# Altium schematic sheet Main.SchDoc
size A3; SheetNumber: 1; SheetTotal: 5; SPICEModelCacheLDJSNXER: <root> / <DocumentId>LDJSNXER</DocumentId> / <CacheFrame Number="0"> / <Model Name="861141486026_680uf" Kind="CKT"> / <Text>******* / .subckt 861141486026_680uF 1 2 / Rser 1 3 0.06 / Lser 2 4 1.05528512515298E-08 / C1 3 4 0.00068 / Rpar 3 4 271162.745854223 / .ends 861141486026_680uF</Text> / </Model> / <Model Name="890263425004cs_2.2uf" Kind="CKT"> / <Text>******* / .subckt 890263425004CS_2.2uF 1 2 / Rser 1 3 0.0196538190645 / Lser 2 4 1.1417797143E-08 / C1 3 4 0.0000022 / Rpar 3 4 1363636363.63636 / .ends 890263425004CS_2.2uF</Text> / </Model> / </CacheFrame> / </root>
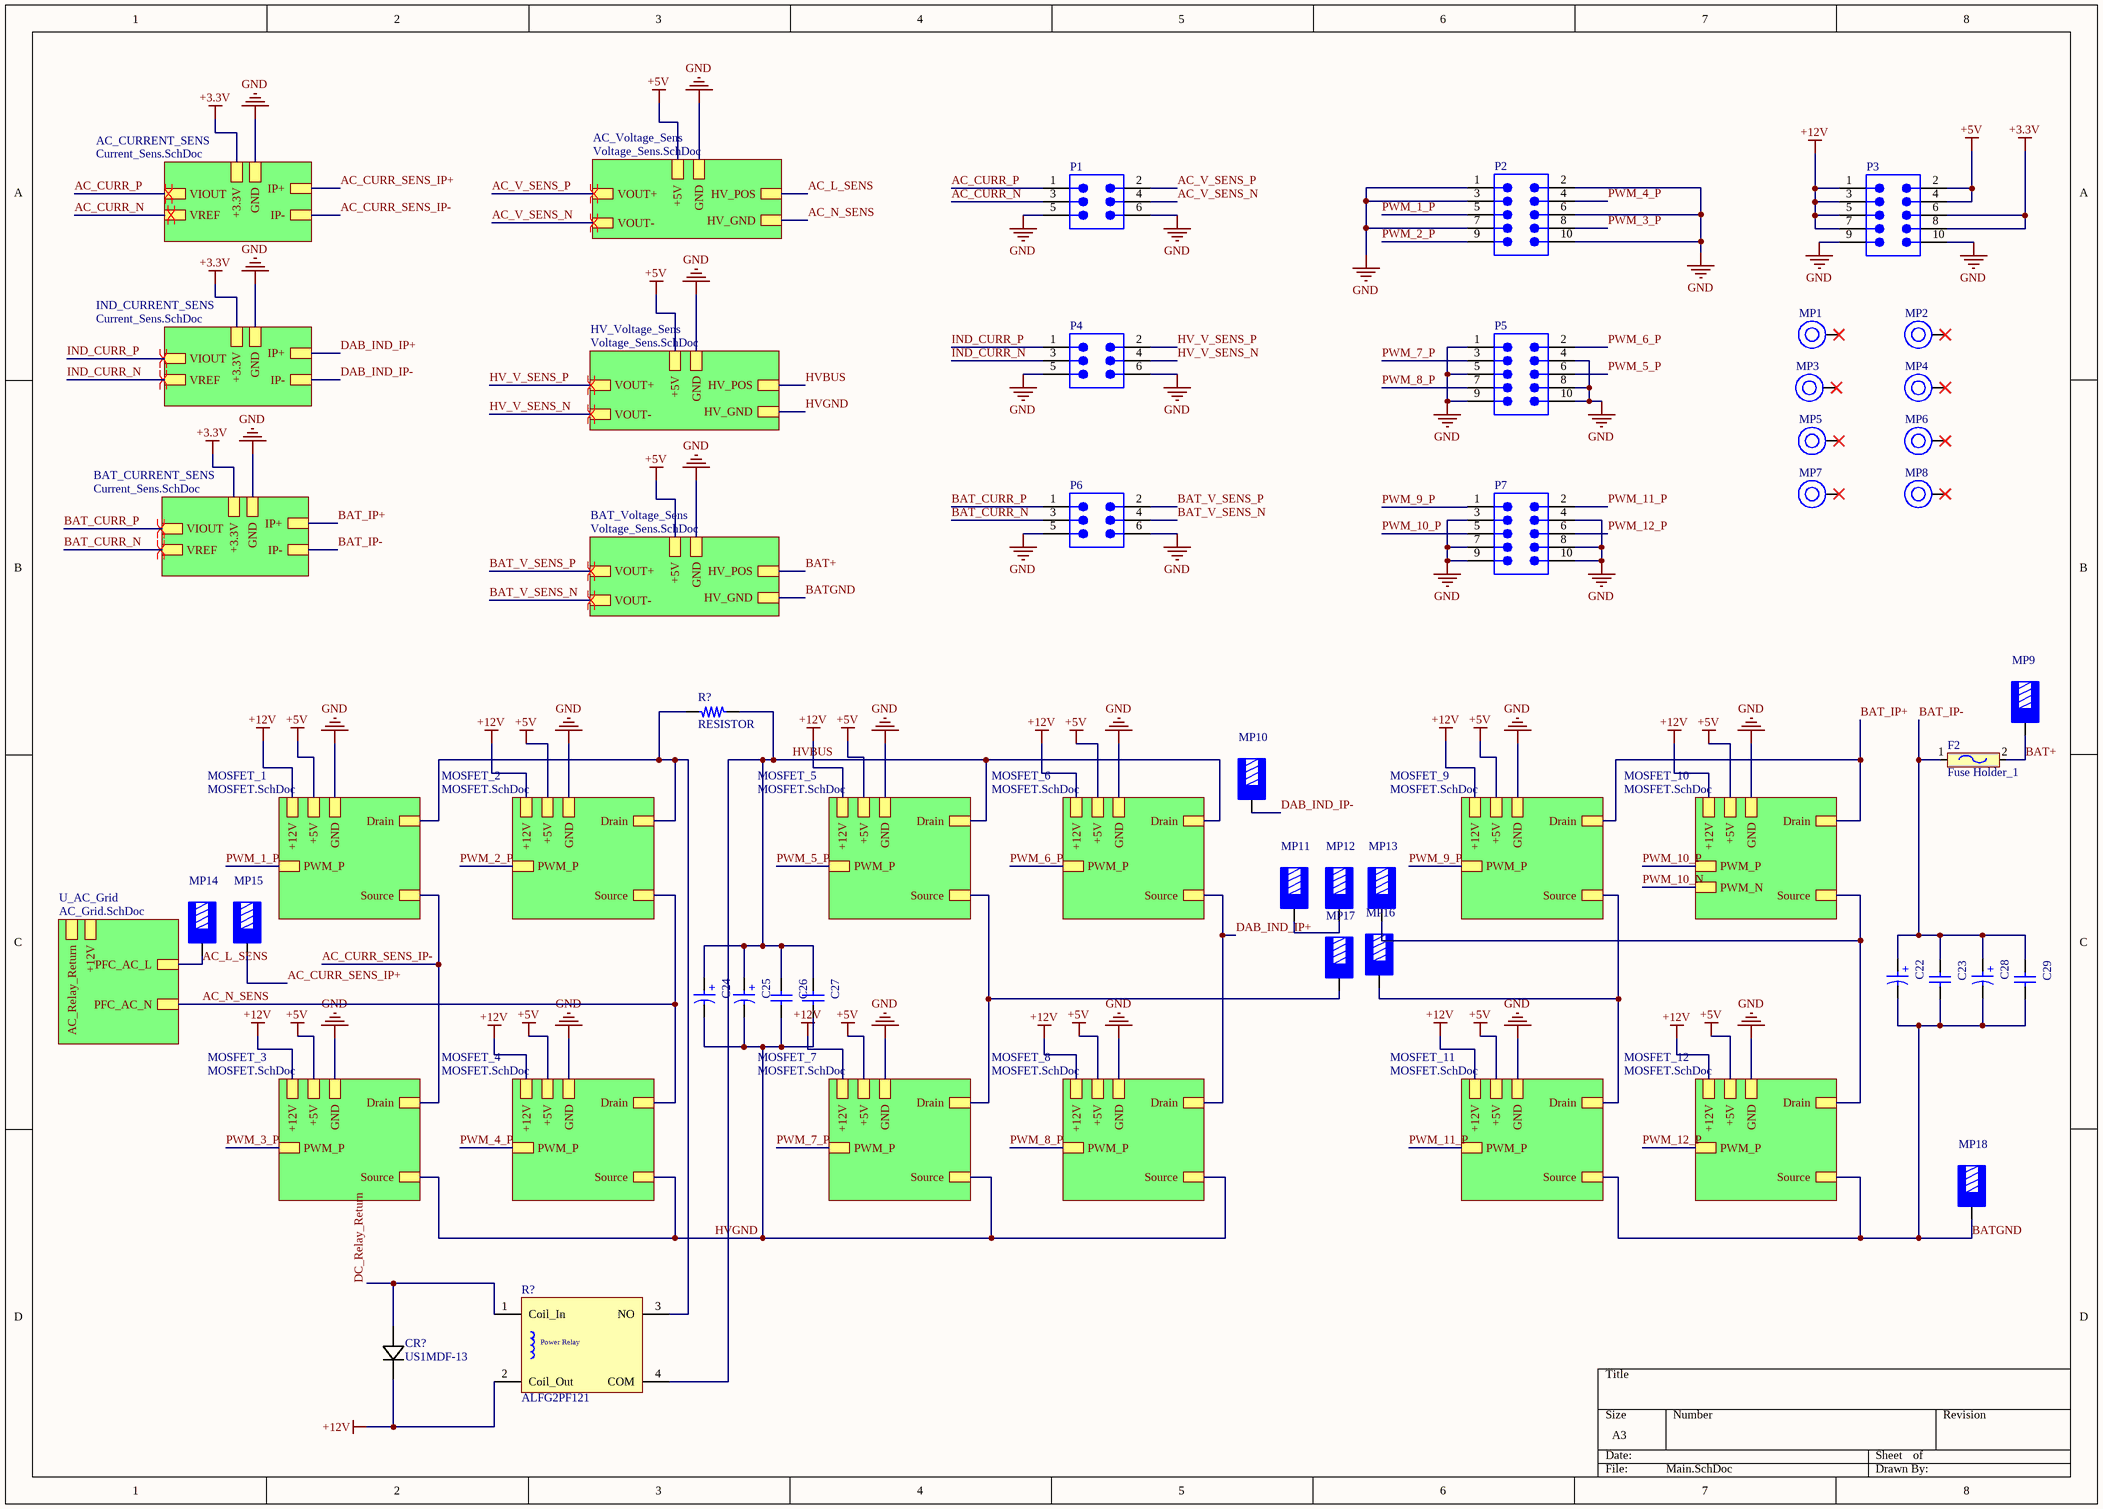
[diagram p0: Main.SchDoc]

## Parts
(Parts that share a designator on the sheet are numbered #1, #2 ... from top to bottom, then left to right.)
C22  680µF  [WCAP-AI3H_D35H55]  (value not drawn)
C23  1.5µF  [WCAP-FTBE_L31W15H24.5]  (value not drawn)
C24  680µF  [WCAP-AI3H_D35H55]  (value not drawn)
C25  680µF  [WCAP-AI3H_D35H55]  (value not drawn)
C26  1.5µF  [WCAP-FTBE_L31W15H24.5]  (value not drawn)
C27  1.5µF  [WCAP-FTBE_L31W15H24.5]  (value not drawn)
C28  680µF  [WCAP-AI3H_D35H55]  (value not drawn)
C29  1.5µF  [WCAP-FTBE_L31W15H24.5]  (value not drawn)
CR?  US1MDF-13  [DIODE_US1MDF-13_DIO-M]
F2  Fuse Holder_1  [Fuse Holder]
MP1  M3 x 10mm  [78614100360]  (value not drawn)
MP2  M3 x 10mm  [78614100360]  (value not drawn)
MP3  M3 x 10mm  [78614100360]  (value not drawn)
MP4  M3 x 10mm  [78614100360]  (value not drawn)
MP5  M3 x 10mm  [78614100360]  (value not drawn)
MP6  M3 x 10mm  [78614100360]  (value not drawn)
MP7  M3 x 10mm  [78614100360]  (value not drawn)
MP8  M3 x 10mm  [78614100360]  (value not drawn)
MP9  M4 x 6mm  [7460307_chemical surface]  (value not drawn)
MP10  M4 x 6mm  [7460307_chemical surface]  (value not drawn)
MP11  M4 x 6mm  [7460307_chemical surface]  (value not drawn)
MP12  M4 x 6mm  [7460307_chemical surface]  (value not drawn)
MP13  M4 x 6mm  [7460307_chemical surface]  (value not drawn)
MP14  M4 x 6mm  [7460307_chemical surface]  (value not drawn)
MP15  M4 x 6mm  [7460307_chemical surface]  (value not drawn)
MP16  M4 x 6mm  [7460307_chemical surface]  (value not drawn)
MP17  M4 x 6mm  [7460307_chemical surface]  (value not drawn)
MP18  M4 x 6mm  [7460307_chemical surface]  (value not drawn)
P1  61300621121  [61300621121]  (value not drawn)
P2  61301021121  [61301021121]  (value not drawn)
P3  61301021121  [61301021121]  (value not drawn)
P4  61300621121  [61300621121]  (value not drawn)
P5  61301021121  [61301021121]  (value not drawn)
P6  61300621121  [61300621121]  (value not drawn)
P7  61301021121  [61301021121]  (value not drawn)
R?#1  RESISTOR  [Power Resistor]
R?#2  ALFG2PF121  [Power Relay]

## Sub-sheets
AC_CURRENT_SENS = Current_Sens.SchDoc: +3.3V, GND, VIOUT, VREF, IP+, IP-
AC_Voltage_Sens = Voltage_Sens.SchDoc: VOUT+, VOUT-, HV_POS, HV_GND, +5V, GND
BAT_CURRENT_SENS = Current_Sens.SchDoc: +3.3V, GND, VIOUT, VREF, IP+, IP-
BAT_Voltage_Sens = Voltage_Sens.SchDoc: VOUT+, VOUT-, HV_POS, HV_GND, +5V, GND
HV_Voltage_Sens = Voltage_Sens.SchDoc: VOUT+, VOUT-, HV_POS, HV_GND, +5V, GND
IND_CURRENT_SENS = Current_Sens.SchDoc: +3.3V, GND, VIOUT, VREF, IP+, IP-
MOSFET_1 = MOSFET.SchDoc: PWM_P, Drain, Source, +12V, +5V, GND
MOSFET_2 = MOSFET.SchDoc: PWM_P, Drain, Source, +12V, +5V, GND
MOSFET_3 = MOSFET.SchDoc: PWM_P, Drain, Source, +12V, +5V, GND
MOSFET_4 = MOSFET.SchDoc: PWM_P, Drain, Source, +12V, +5V, GND
MOSFET_5 = MOSFET.SchDoc: PWM_P, Drain, Source, +12V, +5V, GND
MOSFET_6 = MOSFET.SchDoc: PWM_P, Drain, Source, +12V, +5V, GND
MOSFET_7 = MOSFET.SchDoc: PWM_P, Drain, Source, +12V, +5V, GND
MOSFET_8 = MOSFET.SchDoc: PWM_P, Drain, Source, +12V, +5V, GND
MOSFET_9 = MOSFET.SchDoc: PWM_P, Drain, Source, +12V, +5V, GND
MOSFET_10 = MOSFET.SchDoc: PWM_P, PWM_N, Drain, Source, +12V, +5V, GND
MOSFET_11 = MOSFET.SchDoc: PWM_P, Drain, Source, +12V, +5V, GND
MOSFET_12 = MOSFET.SchDoc: PWM_P, Drain, Source, +12V, +5V, GND
U_AC_Grid = AC_Grid.SchDoc: PFC_AC_L, PFC_AC_N, +12V, AC_Relay_Return

## Nets
+3.3V: P3.6 P3.8 ; sheet AC_CURRENT_SENS/+3.3V, sheet IND_CURRENT_SENS/+3.3V, sheet BAT_CURRENT_SENS/+3.3V
+5V: P3.2 P3.4 ; sheet MOSFET_1/+5V, sheet AC_Voltage_Sens/+5V, sheet MOSFET_3/+5V, sheet MOSFET_2/+5V, sheet MOSFET_4/+5V, sheet MOSFET_5/+5V, sheet MOSFET_7/+5V, sheet MOSFET_6/+5V, sheet MOSFET_8/+5V, sheet MOSFET_9/+5V, sheet MOSFET_11/+5V, sheet MOSFET_10/+5V, sheet MOSFET_12/+5V, sheet HV_Voltage_Sens/+5V, sheet BAT_Voltage_Sens/+5V
+12V: CR?.1 P3.1 P3.3 P3.5 P3.7 R?#2.2(Coil_Out) ; sheet MOSFET_1/+12V, sheet MOSFET_3/+12V, sheet MOSFET_2/+12V, sheet MOSFET_4/+12V, sheet MOSFET_5/+12V, sheet MOSFET_7/+12V, sheet MOSFET_6/+12V, sheet MOSFET_8/+12V, sheet MOSFET_9/+12V, sheet MOSFET_11/+12V, sheet MOSFET_10/+12V, sheet MOSFET_12/+12V
GND: P1.5 P1.6 P2.1 P2.2 P2.3 P2.6 P2.7 P2.10 P3.9 P3.10 P4.5 P4.6 P5.1 P5.4 P5.5 P5.8 P5.9 P5.10 P6.5 P6.6 P7.3 P7.4 P7.7 P7.8 P7.9 P7.10 ; sheet MOSFET_1/GND, sheet AC_Voltage_Sens/GND, sheet MOSFET_3/GND, sheet MOSFET_2/GND, sheet MOSFET_4/GND, sheet MOSFET_5/GND, sheet MOSFET_7/GND, sheet MOSFET_6/GND, sheet MOSFET_8/GND, sheet MOSFET_9/GND, sheet MOSFET_11/GND, sheet MOSFET_10/GND, sheet MOSFET_12/GND, sheet AC_CURRENT_SENS/GND, sheet IND_CURRENT_SENS/GND, sheet BAT_CURRENT_SENS/GND, sheet HV_Voltage_Sens/GND, sheet BAT_Voltage_Sens/GND
AC_CURR_N: P1.3 ; sheet AC_CURRENT_SENS/VREF
AC_CURR_P: P1.1 ; sheet AC_CURRENT_SENS/VIOUT
AC_CURR_SENS_IP+: MP15.1 ; sheet AC_CURRENT_SENS/IP+
AC_CURR_SENS_IP-: sheet MOSFET_1/Source, sheet MOSFET_3/Drain, sheet AC_CURRENT_SENS/IP-
AC_L_SENS: MP14.1 ; sheet U_AC_Grid/PFC_AC_L, sheet AC_Voltage_Sens/HV_POS
AC_N_SENS: sheet U_AC_Grid/PFC_AC_N, sheet AC_Voltage_Sens/HV_GND, sheet MOSFET_2/Source, sheet MOSFET_4/Drain
AC_V_SENS_N: P1.4 ; sheet AC_Voltage_Sens/VOUT-
AC_V_SENS_P: P1.2 ; sheet AC_Voltage_Sens/VOUT+
BAT+: F2.2(VCC26) MP9.1 ; sheet BAT_Voltage_Sens/HV_POS
BAT_CURR_N: P6.3 ; sheet BAT_CURRENT_SENS/VREF
BAT_CURR_P: P6.1 ; sheet BAT_CURRENT_SENS/VIOUT
BAT_IP+: sheet MOSFET_9/Drain, sheet MOSFET_10/Drain, sheet BAT_CURRENT_SENS/IP+
BAT_IP-: C22.1(P) C23.1 C28.1(P) C29.1 F2.1(VCC27) ; sheet BAT_CURRENT_SENS/IP-
BAT_V_SENS_N: P6.4 ; sheet BAT_Voltage_Sens/VOUT-
BAT_V_SENS_P: P6.2 ; sheet BAT_Voltage_Sens/VOUT+
BATGND: C22.2(N) C23.2 C28.2(N) C29.2 MP18.1 ; sheet MOSFET_11/Source, sheet MOSFET_12/Source, sheet BAT_Voltage_Sens/HV_GND
DAB_IND_IP+: sheet MOSFET_6/Source, sheet MOSFET_8/Drain, sheet IND_CURRENT_SENS/IP+
DAB_IND_IP-: MP10.1 ; sheet IND_CURRENT_SENS/IP-
DC_Relay_Return: CR?.2 R?#2.1(Coil_In)
HV_V_SENS_N: P4.4 ; sheet HV_Voltage_Sens/VOUT-
HV_V_SENS_P: P4.2 ; sheet HV_Voltage_Sens/VOUT+
HVBUS: C24.1(P) C25.1(P) C26.1 C27.1 R?#1.2(BOT) R?#2.4(COM) ; sheet MOSFET_5/Drain, sheet MOSFET_6/Drain, sheet HV_Voltage_Sens/HV_POS
HVGND: C24.2(N) C25.2(N) C26.2 C27.2 ; sheet MOSFET_3/Source, sheet MOSFET_4/Source, sheet MOSFET_7/Source, sheet MOSFET_8/Source, sheet HV_Voltage_Sens/HV_GND
IND_CURR_N: P4.3 ; sheet IND_CURRENT_SENS/VREF
IND_CURR_P: P4.1 ; sheet IND_CURRENT_SENS/VIOUT
PWM_1_P: P2.5 ; sheet MOSFET_1/PWM_P
PWM_2_P: P2.9 ; sheet MOSFET_2/PWM_P
PWM_3_P: P2.8 ; sheet MOSFET_3/PWM_P
PWM_4_P: P2.4 ; sheet MOSFET_4/PWM_P
PWM_5_P: P5.6 ; sheet MOSFET_5/PWM_P
PWM_6_P: P5.2 ; sheet MOSFET_6/PWM_P
PWM_7_P: P5.3 ; sheet MOSFET_7/PWM_P
PWM_8_P: P5.7 ; sheet MOSFET_8/PWM_P
PWM_9_P: P7.1 ; sheet MOSFET_9/PWM_P
PWM_10_N: sheet MOSFET_10/PWM_N
PWM_10_P: P7.5 ; sheet MOSFET_10/PWM_P
PWM_11_P: P7.2 ; sheet MOSFET_11/PWM_P
PWM_12_P: P7.6 ; sheet MOSFET_12/PWM_P
NetMP11_1: MP11.1 MP12.1
NetMP13_1: MP13.1 ; sheet MOSFET_10/Source, sheet MOSFET_12/Drain
NetMP16_1: MP16.1 ; sheet MOSFET_9/Source, sheet MOSFET_11/Drain
NetMP17_1: MP17.1 ; sheet MOSFET_5/Source, sheet MOSFET_7/Drain
NetR?#1_1: R?#1.1(TOP) R?#2.3(NO) ; sheet MOSFET_1/Drain, sheet MOSFET_2/Drain

Not connected (* = marked no-connect by the designer): MP1 1*; MP2 1*; MP3 1*; MP4 1*; MP5 1*; MP6 1*; MP7 1*; MP8 1*

## Layout directives
differential pair: AC_CURR_N, AC_CURR_P, AC_V_SENS_N, AC_V_SENS_P, BAT_CURR_N, BAT_CURR_P, BAT_V_SENS_N, BAT_V_SENS_P, HV_V_SENS_N, HV_V_SENS_P, IND_CURR_N, IND_CURR_P

## Notes on the sheet
- (in symbol 861141486026) +

## Library data of the parts
C22 C24 C25 C28 = 861141486026: WCAP-AI3H Aluminum Electrolytic Capacitor, THT, D35 x H55mm, 680µF, 450V; Manufacturer: Wurth Elektronik; Dissipation Factor: 20%; Endurance: 3000h; Leakage Current: 1659.52µA; Ripple Current: 2200mA; Manufacturer Part Number: 861141486026; Category: Aluminum Electrolytic Capacitors; Match Code: WCAP-AI3H; ComponentLink1Description: Website Link; ComponentLink1URL: https://www.we-online.com/redexpert/article/861141486026?ad; ComponentLink2Description: Datasheet Link; ComponentLink2URL: https://www.we-online.com/redexpert/spec/861141486026?ad; Mount: Through Hole; Min Operating Temperature: -25°C; Max Operating Temperature: 105°C; Packaging: Tray; Height: 55mm; Diameter: 35mm; Capacitance: 680µF; Lead Pitch: 10mm; Rated Voltage (DC): 450V
C23 C26 C27 C29 = 890303427009CS: WCAP-FTBE Film Capacitor, THT, L31 x W15 x H24.5mm, 1.5µF, 630V; Manufacturer: Wurth Elektronik; Dissipation Factor @1kHz: 1%; Insulation Resistance: 2GΩ; Rate of Voltage Rise: 17V/µs; Rated Voltage @85degC: 630V (DC); Rated Voltage @105degC: 504V (DC); Manufacturer Part Number: 890303427009CS; Category: Film Capacitors; Match Code: WCAP-FTBE; ComponentLink1Description: Website Link; ComponentLink1URL: https://www.we-online.com/redexpert/article/890303427009CS?ad; ComponentLink2Description: Datasheet Link; ComponentLink2URL: https://www.we-online.com/redexpert/spec/890303427009CS?ad; Mount: Through Hole; Min Operating Temperature: -40°C; Max Operating Temperature: 85°C; Packaging: Carton; Length: 31mm; Width: 15mm; Height: 24.5mm; Capacitance: 1.5µF
CR? = US1MDF-13: No Description Available; Mfr_Name: Diodes Inc; Type: DEV; Copyright: Copyright (C) 2021 Ultra Librarian. All rights reserved.; Manufacturer_Part_Number: US1MDF-13; RefDes: RefDes
MP1-MP8 = 78614100360: WA-SMSA SMT Spacer Studs Automotive, OD 6mm, ID 4.2mm, M3 x 10mm; Manufacturer: Wurth Elektronik; Surface: Tin; Solder Cream Thickness Min: 150um; Tightenning Torque Max: 0.5N*m; Manufacturer Part Number: 78614100360; Category: SMT Spacers; Match Code: WA-SMSA; ComponentLink1Description: Website Link; ComponentLink1URL: https://www.we-online.com/redexpert/article/78614100360?ad; ComponentLink2Description: Datasheet Link; ComponentLink2URL: https://www.we-online.com/redexpert/spec/78614100360?ad; Mount: Surface Mount; Min Operating Temperature: -55°C; Max Operating Temperature: 150°C; Packaging: Tape and Reel; Height: 10mm; Automotive: Yes; Inside Diameter: 4.2mm; Material: Steel; Outside Diameter: 6mm; Thread Size: M3
MP9-MP18 = 7460307: WP-BUTR REDCUBE PRESS-FIT with internal thread, two-rows, L9W9H7mm, M4 x 6mm, 160A; Manufacturer: Wurth Elektronik; Surface: Tin; Manufacturer Part Number: 7460307; Category: REDCUBE PRESS-FIT; Match Code: WP-BUTR; ComponentLink1Description: Website Link; ComponentLink1URL: https://www.we-online.com/redexpert/article/7460307?ad; ComponentLink2Description: Datasheet Link; ComponentLink2URL: https://www.we-online.com/redexpert/spec/7460307?ad; Mount: Press Fit; Min Operating Temperature: -55°C; Max Operating Temperature: 150°C; Packaging: Bulk; Length: 9mm; Width: 9mm; Height: 7mm; Material: Brass; Number of Pins: 8; Rated Current: 160A; Thread Length: 6mm; Thread Size: M4
P1 P4 P6 = 61300621121: WR-PHD Pin Header, THT, Vertical, pitch 2.54mm, 2 Row, 6P; Manufacturer: Wurth Elektronik; Contact Resistance: 20mOhm; Rated Current: 3A; Working Voltage: 250V; Withstanding Voltage: 500V; Manufacturer Part Number: 61300621121; Category: Board-to-Board Connectors; Match Code: WR-PHD; ComponentLink1Description: Website Link; ComponentLink1URL: https://www.we-online.com/redexpert/article/61300621121?ad; ComponentLink2Description: Datasheet Link; ComponentLink2URL: https://www.we-online.com/redexpert/spec/61300621121?ad; Mount: Through Hole; Min Operating Temperature: -40°C; Max Operating Temperature: 105°C; Packaging: Bag; Gender: Pin Header; Number of Pins: 6; Number of Rows: 2; Orientation: Vertical; Lead Pitch: 2.54mm
P2 P3 P5 P7 = 61301021121: WR-PHD Pin Header, THT, Vertical, pitch 2.54mm, 2 Row, 10P; Manufacturer: Wurth Elektronik; Contact Resistance: 20mOhm; Rated Current: 3A; Working Voltage: 250V; Withstanding Voltage: 500V; Manufacturer Part Number: 61301021121; Category: Board-to-Board Connectors; Match Code: WR-PHD; ComponentLink1Description: Website Link; ComponentLink1URL: https://www.we-online.com/redexpert/article/61301021121?ad; ComponentLink2Description: Datasheet Link; ComponentLink2URL: https://www.we-online.com/redexpert/spec/61301021121?ad; Mount: Through Hole; Min Operating Temperature: -40°C; Max Operating Temperature: 105°C; Packaging: Bag; Gender: Pin Header; Number of Pins: 10; Number of Rows: 2; Orientation: Vertical; Lead Pitch: 2.54mm
R?#1 = RESISTOR: Manufacturer: TE CONNECTIVITY; Manufacturer Part Number: 352124KFT; Product Range: 3520 Series; Resistance: 24; Power Rating: 2; Resistance Tolerance: ± 1%; Voltage Rating: 250; Resistor Case Style: 2512 [6432 Metric]; Temperature Coefficient: ± 100; SVHC: No SVHC (15-Jun-2015); Resistor Mounting: SMD<!--FANDB--><div class="features-and-benefits-container"></div>; Supplier 1: Farnell; RoHS: YES; Stock 1: 6653; Pricing 1: 1=0.481, 150=0.1603, 400=0.1374, 1000=0.1069, 2000=0.0875, 4000=0.0764, 20000=0.0749, 40000=0.0733 (GBP); Packaging: Cut Tape; Resistor Element Material: -; MSL: -; ComponentLink1URL: http://www.farnell.com/datasheets/1610601.pdf; ComponentLink1Description: http://www.farnell.com/datasheets/1610601.pdf
R?#2 = Power Relay